# Altium schematic sheet Display.SchDoc
size A4; SheetNumber: 3; SheetTotal: 5
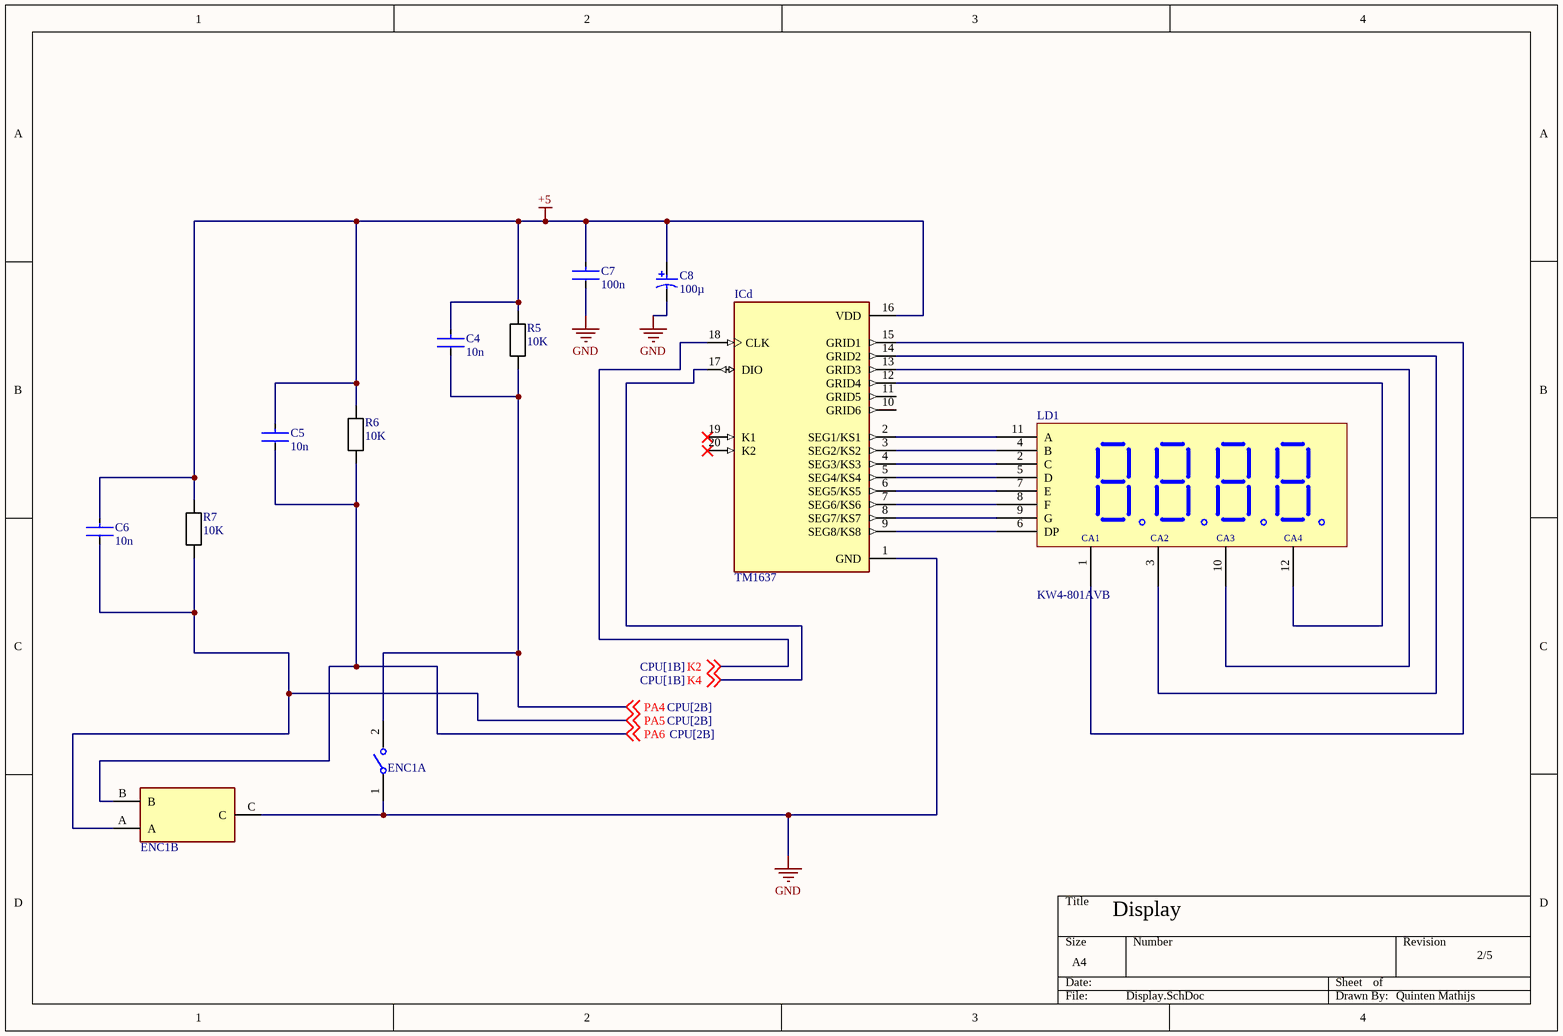
[diagram p0: Display.SchDoc]

## Parts
C4  10n  [CC_0805_L]
C5  10n  [CC_0805_L]
C6  10n  [CC_0805_L]
C7  100n  [CC_0805_L]
C8  100µ  [CE_D8_L10]
ENC1  PEC11R-4220F-S0012  [PEC11R_4220F_S0012]  (value not drawn)  (parts A,B of 2)
ICd  TM1637  [SOP_20_M]
LD1  KW4-801AVB  [7-Segment]
R5  10K  [R_0805_L]
R6  10K  [R_0805_L]
R7  10K  [R_0805_L]

## Nets
+5: C4.1 C5.1 C6.1 C7.1 C8.2 ICd.16(VDD) R5.2 R6.2 R7.1
GND: C7.2 C8.1 ENC1.1 ENC1.C ICd.1(GND)
K2: ICd.18(CLK) ; off-sheet K2
K4: ICd.17(DIO) ; off-sheet K4
PA4: C4.2 ENC1.2 R5.1 ; off-sheet PA4
PA5: C6.2 ENC1.A R7.2 ; off-sheet PA5
PA6: C5.2 ENC1.B R6.1 ; off-sheet PA6
NetICd_2: ICd.2(SEG1/KS1) LD1.11(A)
NetICd_3: ICd.3(SEG2/KS2) LD1.4(B)
NetICd_4: ICd.4(SEG3/KS3) LD1.2(C)
NetICd_5: ICd.5(SEG4/KS4) LD1.5(D)
NetICd_6: ICd.6(SEG5/KS5) LD1.7(E)
NetICd_7: ICd.7(SEG6/KS6) LD1.8(F)
NetICd_8: ICd.8(SEG7/KS7) LD1.9(G)
NetICd_9: ICd.9(SEG8/KS8) LD1.6(DP)
NetICd_12: ICd.12(GRID4) LD1.12
NetICd_13: ICd.13(GRID3) LD1.10
NetICd_14: ICd.14(GRID2) LD1.3
NetICd_15: ICd.15(GRID1) LD1.1(CA1)

Not connected (* = marked no-connect by the designer): ICd 10(GRID6) 11(GRID5) 19(K1)* 20(K2)*

## Notes on the sheet
- Display
- 2/5
- Quinten Mathijs
- (in symbol KW4-801AVB) CA2; CA3; CA4

## Library data of the parts
C4-C7 = Capacitor_Ceramic: Manufacturer: KEMET; Manufacturer Part Number: C0805C224K5RACTU; Value: 0.22 μF; Temperature Characteristic: X7R; Temperature Coefficient: 30ppm/°C; Tolerance: 0.1; Voltage Rating: 50 V; ComponentLink2URL: https://content.kemet.com/datasheets/KEM_C1003_C0G_SMD.pdf; Device Class L3: Ceramic Capacitors; Lead Free: Yes; Temperature: -55°C to +125°C; RoHS: TRUE; Capacitance: 0.22 μF; Automotive: No; Material: Ceramic; Octopart: https://octopart.com/c0805c224k5ractu-kemet-144670; Temperature Range Low: -55°C; Height: 0.88mm; Device Class L1: Passive Components; Digikey Description: CAP CER 0.22UF 50V X7R 0805; ComponentLink2Description: Datasheet; Mouser Description: CAP CER 0.22UF 50V X7R 0805; Category: Cap; Ipc Land Pattern Name: CAPC200125X78; Temperature Range High: +125°C; Package: C0805C-DN; Device Class L2: Capacitors
C8 = Capacitor_Electrolytic: Manufacturer: Panasonic; Voltage Rating: 25 V; ComponentLink2URL: http://industrial.panasonic.com/cdbs/www-data/pdf/RDE0000/ABA0000C1181.pdf; Height: 10.2 mm; Max Operating Temperature: 105 degC; PackageReference: EEE-FK1E221P; ComponentLink1Description: Manufacturer URL; ComponentLink1URL: http://www.panasonic.com/; Mount: Surface Mount; REACH SVHC: No SVHC; Min Operating Temperature: -55 degC; ComponentLink2Description: Datasheet; DatasheetVersion: 03/2016; Length: 10.2 mm; RoHSCompliant: true; Packaging: Tape and Reel; Package Quantity: 500; Lead Pitch: 3.1 mm; Pins: 2; PackageDescription: 2-Pin Electrolytic Aluminum Capacitor, Body 8.3 x 8.3 mm; Mounting Technology: Surface Mount
ENC1 = PEC11R-4220F-S0012: ROTARY ENCODER MECHANICAL 12PPR; Built in Switch: Yes; Number of Channels: 2; Output Type: Quadrature; Hole Diameter: 7mm; Pulses per Revolution: 12; Termination: PC Pin; Package Quantity: 150; RoHS Compliant: Yes; Mount: Through Hole; Width: 12.5mm; Radiation Hardening: No; Number of Pins: 5; REACH SVHC: No SVHC; Type: Mechanical; Packaging: Bulk; Min Operating Temperature: -30°C; Encoder Type: Mechanical; Height: 13.4mm; Length: 26.5mm; Orientation: Vertical; Max Operating Temperature: 70°C; Series: PEC11R; Detent: Yes
ICd = TM1637: LED Drive Control Special Circuit; MF: Titan Micro Electronics; Package: Package; Availability: Not in stock; SnapEDA_Link: https://www.snapeda.com/parts/TM1637/Titan+Micro+Electronics/view-part/?ref=snap; MP: TM1637; Check_prices: https://www.snapeda.com/parts/TM1637/Titan+Micro+Electronics/view-part/?ref=eda; Value: *; Price: None
LD1 = KW4-801AVB: 4-Digit LED Display
R5-R7 = 0805 (Resistor): Resistor; Manufacturer: Vishay Dale; Part Number: CRCW08050000Z0EA